# Altium schematic sheet VL53L8CX_Option.SchDoc: VL53L8CX Multi-zone
size A4; DrawnBy: Samyar Sadat Akhavi; Revision: 1.0; SheetNumber: 3; SheetTotal: 3
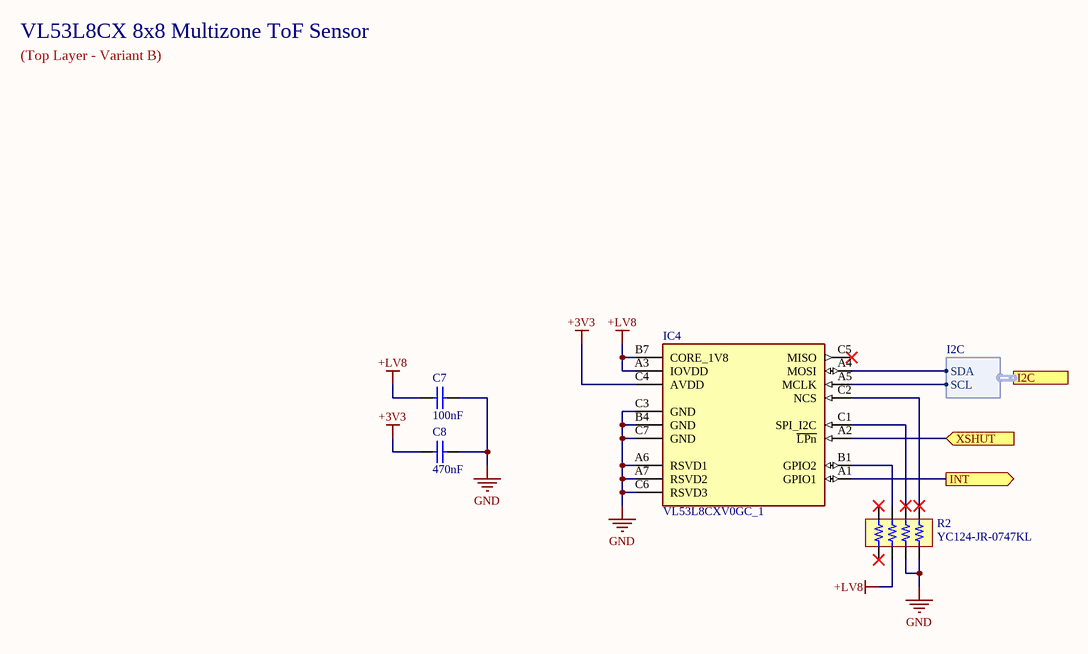
[diagram p0: VL53L8CX_Option.SchDoc]

## Parts
?  (no value)  (graphical)
C7  100nF  [CAP_SMD_603]
C8  470nF  [CAP_SMD_603]
IC4  VL53L8CXV0GC_1  [VL53L8CXV0GC1]
R2  YC124-JR-0747KL  [RESNET 0804-8 CONVEX]

## Ports
I2C (harness I2C, see IR_ToF_Module[2A], VL53L_SZ_Option[3B]), INT (out, see IR_ToF_Module[2A], VL53L_SZ_Option[3C]), XSHUT (in, see IR_ToF_Module[2A], VL53L_SZ_Option[3B])

## Harnesses
I2C: SDA, SCL

## Nets
+3V3: C8.2 IC4.C4(AVDD)
+LV8: C7.1 IC4.A3(IOVDD) IC4.B7(CORE_1V8) R2.2
GND: C7.2 C8.1 IC4.A6(RSVD1) IC4.A7(RSVD2) IC4.B4(GND) IC4.C3(GND) IC4.C6(RSVD3) IC4.C7(GND) R2.3 R2.4
INT: IC4.A1(GPIO1) ; port INT
XSHUT: IC4.A2(~{LPn}) ; port XSHUT
NetIC4_A4: IC4.A4(MOSI) ; port I2C.SDA
NetIC4_A5: IC4.A5(MCLK) ; port I2C.SCL
NetIC4_B1: IC4.B1(GPIO2) R2.7
NetIC4_C1: IC4.C1(SPI_I2C) R2.6
NetIC4_C2: IC4.C2(NCS) R2.5

Not connected (* = marked no-connect by the designer): IC4 C5(MISO)*; R2 1* 8*

## Notes on the sheet
- VL53L8CX 8x8 Multizone ToF Sensor
- (Top Layer - Variant B)
- Sub-Project:
- Size:
- Drawn By:
- Revision:
- Date:
- File:
- Sheet:
- of

## Library data of the parts
? = Standard Title Block
C7 C8 = Non-polar Capacitor: Generic Ceramic Capacitor; Voltage: 6.3V
  C7: Value: 100nF
  C8: Value: 470nF
IC4 = VL53L8CXV0GC_1: Integrated Circuit; Manufacturer_Name: STMicroelectronics; Manufacturer_Part_Number: VL53L8CXV0GC/1; Datasheet Link: https://www.st.com/resource/en/datasheet/vl53l8cx.pdf; Mouser Part Number: 511-VL53L8CXV0GC/1; Mouser Price/Stock: https://www.mouser.co.uk/ProductDetail/STMicroelectronics/VL53L8CXV0GC-1?qs=T%252BzbugeAwjhc9idkQC%252BF8g%3D%3D; Arrow Part Number: VL53L8CXV0GC/1; Arrow Price/Stock: https://www.arrow.com/en/products/vl53l8cxv0gc1/stmicroelectronics?utm_currency=USD&region=europe
R2 = YC124-JR-0747KL: RES ARRAY 4 RES 47K OHM 0804; Manufacturer: Yageo; Circuit Type: Isolated; Number of Resistors: 4; Power Per Element: 62.5mW; Temperature Coefficient: ±200ppm/°C; Tolerance: ±5%; Part Number: YC124-JR-0747KL; Applications: DDRAM, SDRAM; ComponentLink1Description: Datasheet; ComponentLink1URL: https://www.yageo.com/upload/media/product/productsearch/datasheet/rchip/PYu-YC_TC_group_51_RoHS_L_9.pdf; ComponentLink2Description: DigiKey Link; ComponentLink2URL: https://www.digikey.com/en/products/detail/yageo/YC124-JR-0747KL/1005035; Height - Seated (Max): 0.022" (0.55mm); LastUpdated: 6/3/2024 8:05:56 PM; Lifecycle Status: Active; Minimum Order: 1; Mounting Type: Surface Mount; Number of Pins: 8; Operating Temperature: -55°C ~ 155°C; Package / Case: 0804, Convex, Long Side Terminals; Packaging: TapeAndReel; PartId: 481; Part Status: Active; Price: 0.01; Resistance (Ohms): 47k; Series: YC124; Size / Dimension: 0.079" L x 0.039" W (2.00mm x 1.00mm); Supplier 1: DigiKey; Supplier Part Number 1: YC124J-47KCT-ND